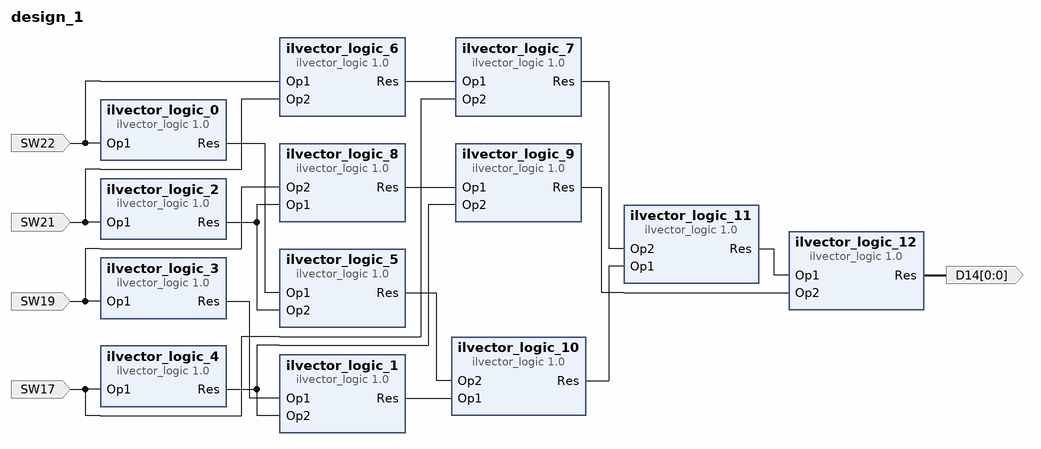
[diagram p0: block diagram of the top level]
# Vivado block design design_1, xc7s15ftgb196-1, Vivado 2025.2
create_bd_design design_1

create_bd_port -dir I -type data SW22
create_bd_port -dir I SW21
create_bd_port -dir I SW19
create_bd_port -dir I SW17
create_bd_port -dir O -from 0 -to 0 -type data D14

create_bd_cell -type inline_hdl -vlnv xilinx.com:inline_hdl:ilvector_logic:1.0 ilvector_logic_0
set_property -dict {CONFIG.C_OPERATION not CONFIG.C_SIZE 1} [get_bd_cells ilvector_logic_0]
create_bd_cell -type inline_hdl -vlnv xilinx.com:inline_hdl:ilvector_logic:1.0 ilvector_logic_1
set_property -dict {CONFIG.C_SIZE 1} [get_bd_cells ilvector_logic_1]
create_bd_cell -type inline_hdl -vlnv xilinx.com:inline_hdl:ilvector_logic:1.0 ilvector_logic_2
set_property -dict {CONFIG.C_OPERATION not CONFIG.C_SIZE 1} [get_bd_cells ilvector_logic_2]
create_bd_cell -type inline_hdl -vlnv xilinx.com:inline_hdl:ilvector_logic:1.0 ilvector_logic_3
set_property -dict {CONFIG.C_OPERATION not CONFIG.C_SIZE 1} [get_bd_cells ilvector_logic_3]
create_bd_cell -type inline_hdl -vlnv xilinx.com:inline_hdl:ilvector_logic:1.0 ilvector_logic_4
set_property -dict {CONFIG.C_OPERATION not CONFIG.C_SIZE 1} [get_bd_cells ilvector_logic_4]
create_bd_cell -type inline_hdl -vlnv xilinx.com:inline_hdl:ilvector_logic:1.0 ilvector_logic_5
set_property -dict {CONFIG.C_SIZE 1} [get_bd_cells ilvector_logic_5]
create_bd_cell -type inline_hdl -vlnv xilinx.com:inline_hdl:ilvector_logic:1.0 ilvector_logic_6
set_property -dict {CONFIG.C_SIZE 1} [get_bd_cells ilvector_logic_6]
create_bd_cell -type inline_hdl -vlnv xilinx.com:inline_hdl:ilvector_logic:1.0 ilvector_logic_7
set_property -dict {CONFIG.C_SIZE 1} [get_bd_cells ilvector_logic_7]
create_bd_cell -type inline_hdl -vlnv xilinx.com:inline_hdl:ilvector_logic:1.0 ilvector_logic_8
set_property -dict {CONFIG.C_SIZE 1} [get_bd_cells ilvector_logic_8]
create_bd_cell -type inline_hdl -vlnv xilinx.com:inline_hdl:ilvector_logic:1.0 ilvector_logic_9
set_property -dict {CONFIG.C_SIZE 1} [get_bd_cells ilvector_logic_9]
create_bd_cell -type inline_hdl -vlnv xilinx.com:inline_hdl:ilvector_logic:1.0 ilvector_logic_10
set_property -dict {CONFIG.C_OPERATION or CONFIG.C_SIZE 1} [get_bd_cells ilvector_logic_10]
create_bd_cell -type inline_hdl -vlnv xilinx.com:inline_hdl:ilvector_logic:1.0 ilvector_logic_11
set_property -dict {CONFIG.C_OPERATION or CONFIG.C_SIZE 1} [get_bd_cells ilvector_logic_11]
create_bd_cell -type inline_hdl -vlnv xilinx.com:inline_hdl:ilvector_logic:1.0 ilvector_logic_12
set_property -dict {CONFIG.C_OPERATION or CONFIG.C_SIZE 1} [get_bd_cells ilvector_logic_12]

# ---- connections ----

connect_bd_net -net SW17_1 [get_bd_ports SW17] [get_bd_pins ilvector_logic_4/Op1] [get_bd_pins ilvector_logic_7/Op2]
connect_bd_net -net SW19_1 [get_bd_ports SW19] [get_bd_pins ilvector_logic_3/Op1] [get_bd_pins ilvector_logic_8/Op2]
connect_bd_net -net SW21_1 [get_bd_ports SW21] [get_bd_pins ilvector_logic_2/Op1] [get_bd_pins ilvector_logic_6/Op2]
connect_bd_net -net SW22_1 [get_bd_ports SW22] [get_bd_pins ilvector_logic_0/Op1] [get_bd_pins ilvector_logic_6/Op1]
connect_bd_net [get_bd_pins ilvector_logic_0/Res] [get_bd_pins ilvector_logic_5/Op1]
connect_bd_net [get_bd_pins ilvector_logic_10/Res] [get_bd_pins ilvector_logic_11/Op1]
connect_bd_net [get_bd_pins ilvector_logic_11/Res] [get_bd_pins ilvector_logic_12/Op1]
connect_bd_net [get_bd_pins ilvector_logic_12/Res] [get_bd_ports D14]
connect_bd_net [get_bd_pins ilvector_logic_1/Res] [get_bd_pins ilvector_logic_10/Op1]
connect_bd_net [get_bd_pins ilvector_logic_2/Res] [get_bd_pins ilvector_logic_5/Op2] [get_bd_pins ilvector_logic_8/Op1]
connect_bd_net [get_bd_pins ilvector_logic_3/Res] [get_bd_pins ilvector_logic_1/Op1]
connect_bd_net [get_bd_pins ilvector_logic_4/Res] [get_bd_pins ilvector_logic_1/Op2] [get_bd_pins ilvector_logic_9/Op2]
connect_bd_net [get_bd_pins ilvector_logic_5/Res] [get_bd_pins ilvector_logic_10/Op2]
connect_bd_net [get_bd_pins ilvector_logic_6/Res] [get_bd_pins ilvector_logic_7/Op1]
connect_bd_net [get_bd_pins ilvector_logic_7/Res] [get_bd_pins ilvector_logic_11/Op2]
connect_bd_net [get_bd_pins ilvector_logic_8/Res] [get_bd_pins ilvector_logic_9/Op1]
connect_bd_net [get_bd_pins ilvector_logic_9/Res] [get_bd_pins ilvector_logic_12/Op2]

validate_bd_design
save_bd_design
